# EAGLE design one_led (EAGLE 6.6.0)
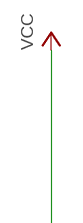
[diagram p0: schematic, sheet 1, part 1 of 2]
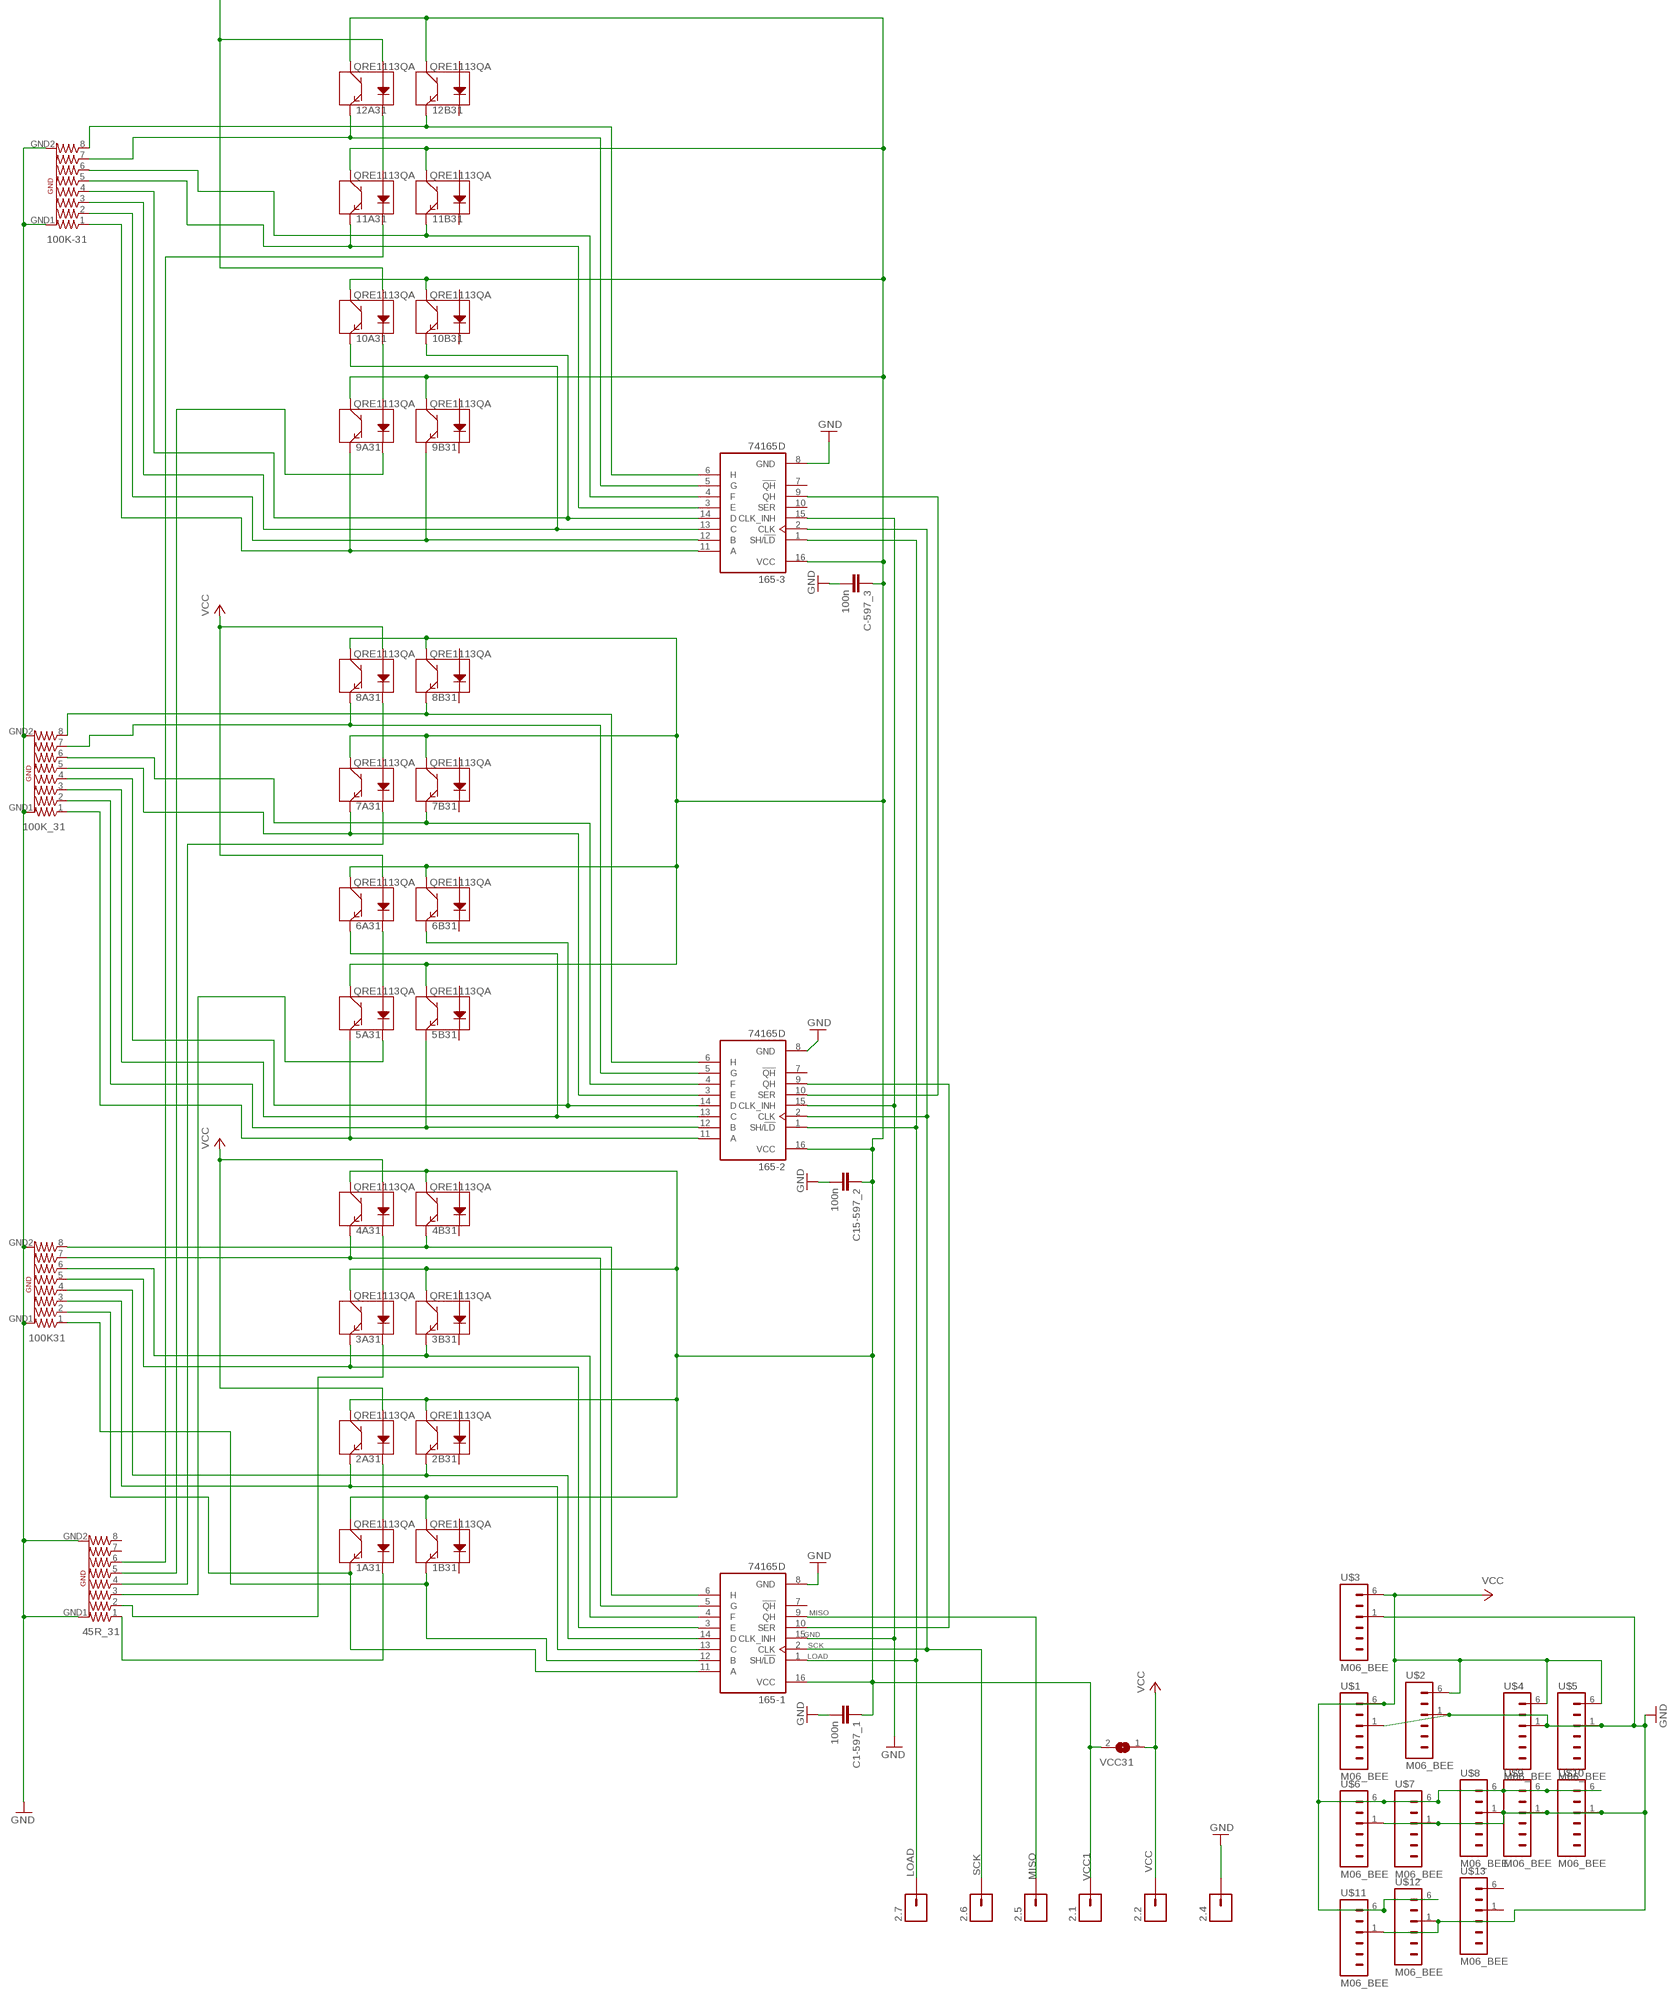
[diagram p1: schematic, sheet 1, part 2 of 2]

## Parts
1A31  QRE1113QA  [QRE1113]
1B31  QRE1113QA  [QRE1113]
2.1  M01ADN  [1X01-16GAUGE]
2.2  M01ADN  [1X01-16GAUGE]
2.4  M01ADN  [1X01-16GAUGE]
2.5  M01ADN  [1X01-16GAUGE]
2.6  M01ADN  [1X01-16GAUGE]
2.7  M01ADN  [1X01-16GAUGE]
2A31  QRE1113QA  [QRE1113]
2B31  QRE1113QA  [QRE1113]
3A31  QRE1113QA  [QRE1113]
3B31  QRE1113QA  [QRE1113]
4A31  QRE1113QA  [QRE1113]
4B31  QRE1113QA  [QRE1113]
5A31  QRE1113QA  [QRE1113]
5B31  QRE1113QA  [QRE1113]
6A31  QRE1113QA  [QRE1113]
6B31  QRE1113QA  [QRE1113]
7A31  QRE1113QA  [QRE1113]
7B31  QRE1113QA  [QRE1113]
8A31  QRE1113QA  [QRE1113]
8B31  QRE1113QA  [QRE1113]
9A31  QRE1113QA  [QRE1113]
9B31  QRE1113QA  [QRE1113]
10A31  QRE1113QA  [QRE1113]
10B31  QRE1113QA  [QRE1113]
11A31  QRE1113QA  [QRE1113]
11B31  QRE1113QA  [QRE1113]
12A31  QRE1113QA  [QRE1113]
12B31  QRE1113QA  [QRE1113]
45R_31  RESISTOR-ARRAY_BUSSED  [1608_ARRAY]
100K31  RESISTOR-ARRAY_BUSSED  [1608_ARRAY]
100K-31  RESISTOR-ARRAY_BUSSED  [1608_ARRAY]
100K_31  RESISTOR-ARRAY_BUSSED  [1608_ARRAY]
165-1  74165D  [SO16]
165-2  74165D  [SO16]
165-3  74165D  [SO16]
C1-597_1  100n  C-EUC0603  [C0603]
C15-597_2  100n  C-EUC0603  [C0603]
C-597_3  100n  C-EUC0603  [C0603]
U$1  M06_BEE  [1X06_BEE]
U$2  M06_BEE  [1X06_BEE]
U$3  M06_BEE  [1X06_BEE]
U$4  M06_BEE  [1X06_BEE]
U$5  M06_BEE  [1X06_BEE]
U$6  M06_BEE  [1X06_BEE]
U$7  M06_BEE  [1X06_BEE]
U$8  M06_BEE  [1X06_BEE]
U$9  M06_BEE  [1X06_BEE]
U$10  M06_BEE  [1X06_BEE]
U$11  M06_BEE  [1X06_BEE]
U$12  M06_BEE  [1X06_BEE]
U$13  M06_BEE  [1X06_BEE]
VCC31  SJ  [SJ]

## Nets
GND: 2.4.1 45R_31.GND1 45R_31.GND2 100K31.GND1 100K31.GND2 100K-31.GND1 100K-31.GND2 100K_31.GND1 100K_31.GND2 165-1.8(GND) 165-1.15(CLK_INH) 165-2.8(GND) 165-2.15(CLK_INH) 165-3.8(GND) 165-3.15(CLK_INH) C1-597_1.2 C15-597_2.2 C-597_3.2 U$1.1 U$2.1 U$3.1 U$4.1 U$5.1 U$6.1 U$7.1 U$8.1 U$9.1 U$10.1 U$11.1 U$12.1
LOAD: 2.7.1 165-1.1(SH/!LD) 165-2.1(SH/!LD) 165-3.1(SH/!LD)
MISO: 2.5.1 165-1.9(QH)
N$18: 3A31.4(E) 100K31.5 165-1.3(E)
N$21: 165-2.10(SER) 165-3.9(QH)
N$30: 1A31.4(E) 100K31.2 165-1.11(A)
N$31: 3A31.2(K) 45R_31.2
N$34: 165-1.10(SER) 165-2.9(QH)
N$48: 1A31.1(A) 2A31.2(K)
N$56: 1A31.2(K) 45R_31.1
N$58: 3B31.4(E) 100K31.6 165-1.4(F)
N$74: 5A31.1(A) 6A31.2(K)
N$78: 6A31.4(E) 100K_31.3 165-2.13(C)
N$94: 5A31.2(K) 45R_31.3
N$100: 1B31.4(E) 100K31.1 165-1.12(B)
N$101: 2A31.4(E) 100K31.3 165-1.13(C)
N$102: 2B31.4(E) 100K31.4 165-1.14(D)
N$103: 3A31.1(A) 4A31.2(K)
N$105: 6B31.4(E) 100K_31.4 165-2.14(D)
N$107: 7A31.1(A) 8A31.2(K)
N$108: 4A31.4(E) 100K31.7 165-1.5(G)
N$109: 4B31.4(E) 100K31.8 165-1.6(H)
N$111: 8A31.4(E) 100K_31.7 165-2.5(G)
N$112: 8B31.4(E) 100K_31.8 165-2.6(H)
N$113: 7A31.2(K) 45R_31.4
N$115: 7A31.4(E) 100K_31.5 165-2.3(E)
N$117: 7B31.4(E) 100K_31.6 165-2.4(F)
N$118: 5B31.4(E) 100K_31.2 165-2.12(B)
N$119: 5A31.4(E) 100K_31.1 165-2.11(A)
N$127: 9A31.1(A) 10A31.2(K)
N$130: 10A31.4(E) 100K-31.3 165-3.13(C)
N$131: 10B31.4(E) 100K-31.4 165-3.14(D)
N$132: 11A31.1(A) 12A31.2(K)
N$134: 12A31.4(E) 100K-31.7 165-3.5(G)
N$135: 12B31.4(E) 100K-31.8 165-3.6(H)
N$136: 11A31.2(K) 45R_31.6
N$138: 11A31.4(E) 100K-31.5 165-3.3(E)
N$140: 11B31.4(E) 100K-31.6 165-3.4(F)
N$141: 9B31.4(E) 100K-31.2 165-3.12(B)
N$142: 9A31.4(E) 100K-31.1 165-3.11(A)
N$143: 9A31.2(K) 45R_31.5
SCK: 2.6.1 165-1.2(CLK) 165-2.2(CLK) 165-3.2(CLK)
VCC: 2.2.1 2A31.1(A) 4A31.1(A) 6A31.1(A) 8A31.1(A) 10A31.1(A) 12A31.1(A) U$1.6 U$2.6 U$3.6 U$4.6 U$5.6 U$6.6 U$7.6 U$8.6 U$9.6 U$10.6 U$11.6 U$12.6 VCC31.1
VCC1: 1A31.3(C) 1B31.3(C) 2.1.1 2A31.3(C) 2B31.3(C) 3A31.3(C) 3B31.3(C) 4A31.3(C) 4B31.3(C) 5A31.3(C) 5B31.3(C) 6A31.3(C) 6B31.3(C) 7A31.3(C) 7B31.3(C) 8A31.3(C) 8B31.3(C) 9A31.3(C) 9B31.3(C) 10A31.3(C) 10B31.3(C) 11A31.3(C) 11B31.3(C) 12A31.3(C) 12B31.3(C) 165-1.16(VCC) 165-2.16(VCC) 165-3.16(VCC) C1-597_1.1 C15-597_2.1 C-597_3.1 VCC31.2
Unconnected: 1B31.1(A) 1B31.2(K) 2B31.1(A) 2B31.2(K) 3B31.1(A) 3B31.2(K) 4B31.1(A) 4B31.2(K) 5B31.1(A) 5B31.2(K) 6B31.1(A) 6B31.2(K) 7B31.1(A) 7B31.2(K) 8B31.1(A) 8B31.2(K) 9B31.1(A) 9B31.2(K) 10B31.1(A) 10B31.2(K) 11B31.1(A) 11B31.2(K) 12B31.1(A) 12B31.2(K) 45R_31.7 45R_31.8 165-1.7(!QH) 165-2.7(!QH) 165-3.7(!QH) 165-3.10(SER) U$13.1 U$13.6

## Library data of the parts
1A31 1B31 2A31 2B31 3A31 3B31 4A31 4B31 5A31 5B31 6A31 6B31 7A31 7B31 8A31 8B31 9A31 9B31 10A31 10B31 11A31 11B31 12A31 12B31 = BeeCounter2:QRE1113: Reflective object sensor
2.1 2.2 2.4-2.7 = OMSI - ADN:M01: Header 1 Standard 1-pin 0.1" header. Use with straight break away headers (SKU : PRT-00116), right angle break away headers (PRT-00553), swiss pins (PRT-00743), machine pins (PRT-00117), and female headers (PRT-00115).
45R_31 100K31 100K-31 100K_31 = Bee Counter 3:RESISTOR-ARRAY_BUSSED: Resistor Array http://industrial.panasonic.com/lecs/www-data/pdf/AOC0000/AOC0000CE3.pdf Digikey: U8470CT-ND Panasonic bussed EXB-E10
165-1-165-3 = SparkFun-DigitalIC:74*165
C1-597_1 C15-597_2 C-597_3 = resistor:C-EU: CAPACITOR, European symbol
U$1-U$13 = Bee Counter 3:M06_BEE
VCC31 = jumper:SJ: SMD solder JUMPER

## Board
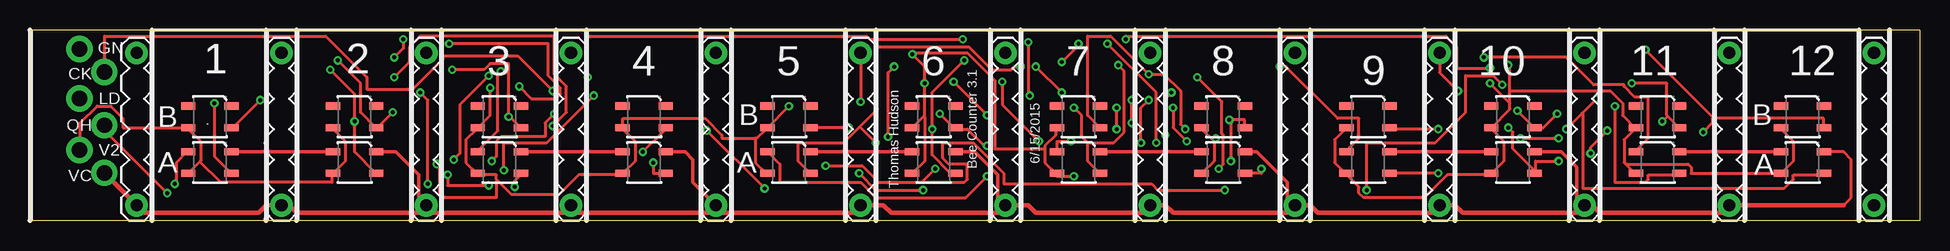
[diagram p2: board, top side]
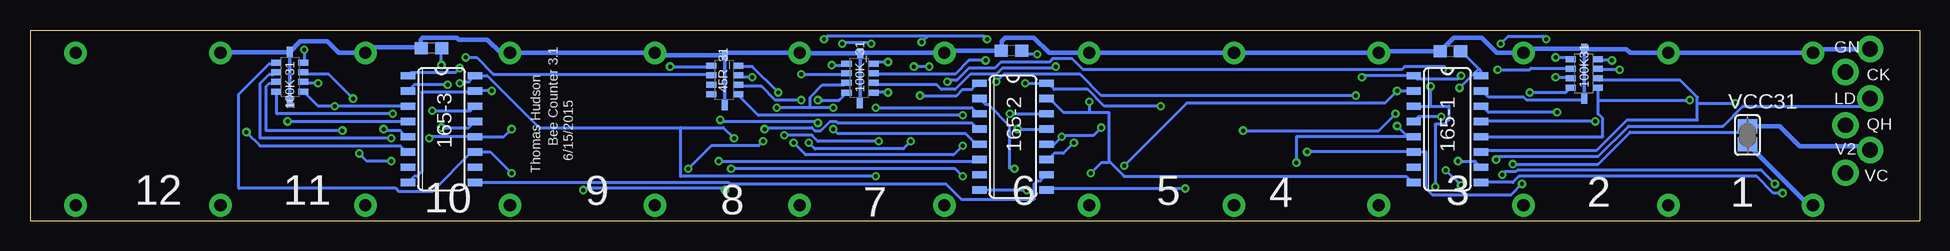
[diagram p3: board, bottom side, seen from below]

Size 157.48 x 15.88 mm. Coordinates in mm from the lower left corner, seen from the top.
Outline: 157.48,15.88 0,15.88 0,0 157.48,0 157.48,15.88
Copper layers (1*16): Top 0.0356mm / dielectric 1.5011mm / Bottom 0.0356mm
Design rules "default": minimum track width 10mil, minimum drill 13mil, track to track 6mil, track to pad 10mil, pad to pad 15mil, via to via 10mil, smd to smd 6mil, copper to edge 15mil, drill to drill 6mil, minimum pad ring 7mil, minimum via ring 7mil, stop-mask expansion 4mil, vias tented up to drill 25mil, thermal gap 10mil

### Footprints (pad centres in the part's own frame; a part is rotated, then mirrored left to right if it is on the bottom)
QRE1113 = smd 1.2 x 0.6: 1 -1.8,-0.9; 2 1.8,-0.9; 3 1.8,0.9; 4 -1.8,0.9
1X01-16GAUGE = drill 1.29 pad 2.184: 1 0,0
1608_ARRAY = smd 0.5 x 0.85: 1 -2.99,0.83; 2 -2.19,0.83; 3 -1.39,0.83; 4 -0.59,0.83; 5 -0.59,3.08; 6 -1.39,3.08; 7 -2.19,3.08; 8 -2.99,3.08 | smd 0.85 x 0.5: GND1 -3.88,1.96; GND2 0.28,1.94
SO16 = smd 0.6 x 1.2: 1 -4.445,-2.8; 2 -3.175,-2.8; 3 -1.905,-2.8; 4 -0.635,-2.8; 5 0.635,-2.8; 6 1.905,-2.8; 7 3.175,-2.8; 8 4.445,-2.8; 9 4.445,2.8; 10 3.175,2.8; 11 1.905,2.8; 12 0.635,2.8; 13 -0.635,2.8; 14 -1.905,2.8; 15 -3.175,2.8; 16 -4.445,2.8
C0603 = smd 1.1 x 1: 1 -0.85,0; 2 0.85,0
1X06_BEE = drill 1.016 pad 1.88: 1 -2.54,0; 6 10.16,0
SJ = smd 1.168 x 1.6: 1 -0.762,0; 2 0.762,0

### Placement (x,y rotation side)
1A31  14.99,4.83 180 top
1B31  14.99,8.64 180 top
2.1  4.13,5.87 0 top
2.2  6.19,3.97 0 top
2.4  4.13,14.29 0 top
2.5  6.19,7.94 0 top
2.6  6.19,12.38 0 top
2.7  4.13,10.16 0 top
2A31  27.05,4.83 180 top
2B31  27.05,8.64 180 top
3A31  39.12,4.83 180 top
3B31  39.12,8.64 180 top
4A31  51.18,4.83 180 top
4B31  51.18,8.64 180 top
5A31  63.25,4.83 180 top
5B31  63.25,8.64 180 top
6A31  75.31,4.83 180 top
6B31  75.31,8.64 180 top
7A31  87.38,4.83 180 top
7B31  87.38,8.64 180 top
8A31  99.44,4.83 180 top
8B31  99.44,8.64 180 top
9A31  111.51,4.83 180 top
9B31  111.51,8.64 180 top
10A31  123.57,4.83 180 top
10B31  123.57,8.64 180 top
11A31  135.64,4.83 180 top
11B31  135.64,8.64 180 top
12A31  147.7,4.83 180 top
12B31  147.7,8.64 180 top
45R_31  97.63,13.49 90 bottom
100K31  26,14.03 90 bottom
100K-31  137.8,10.16 270 bottom
100K_31  86.36,13.65 90 bottom
165-1  39.37,7.62 270 bottom
165-2  75.56,6.99 270 bottom
165-3  123.19,7.62 270 bottom
C1-597_1  75.69,14.16 180 bottom
C15-597_2  39.12,14.1 180 bottom
C-597_3  124.02,14.35 180 bottom
U$1  20.95,11.43 270 top
U$2  33.02,11.43 270 top
U$3  8.89,11.43 270 top
U$4  45.09,11.43 270 top
U$5  57.15,11.43 270 top
U$6  69.22,11.43 270 top
U$7  81.28,11.43 270 top
U$8  93.34,11.43 270 top
U$9  105.41,11.43 270 top
U$10  117.47,11.43 270 top
U$11  129.54,11.43 270 top
U$12  141.61,11.43 270 top
U$13  153.67,11.43 270 top
VCC31  14.35,7.11 90 bottom

### Tracks (layer width: path | path; a pad name or v marks a point on that pad's centre or on a via)
GND  (via drill 0.33)
  Top 0.254: v74.42,2.54 70.49,2.54 v69.09,3.94 | v119,10.79 117.47,12.32 U$10.1 | U$6.1 v69.22,9.91
  Bottom 0.254: 165-1.8 42.29,3.17 42.8,3.68 66.29,3.68 67.5,4.89 | 67.5,4.89 67.56,4.95 67.56,9.02 69.22,9.02 | 69.22,9.02 71.37,9.02 72.52,10.16 165-2.15 | v74.42,2.54 165-2.8 | v69.09,3.94 68.2,4.83 67.56,4.83 67.5,4.89 | 165-3.8 125.48,3.68 125.22,3.68 124.84,4.06 124.84,10.67 120.52,10.67 165-3.15 v119,10.79 | 165-1.15 36.45,10.79 35.94,10.29 33.02,10.29 32.77,10.03 28.07,10.03 100K31.GND1 | U$12.1 141.53,14.04 | v69.22,9.91 69.22,9.02
  Bottom 0.305: 27.92,14.29 100K31.GND2 27.94,10.17 100K31.GND1 | 76.52,14.19 C1-597_1.2 | 88.26,13.97 100K_31.GND2 88.3,9.79 100K_31.GND1 | 93.31,13.93 U$8.1 | 99.38,13.97 45R_31.GND2 99.57,9.63 45R_31.GND1 | 105.21,13.77 U$9.1 | U$10.1 118.27,13.97 | 124.94,14.42 C-597_3.2 | 100K-31.GND1 135.84,9.9 100K-31.GND2
  Bottom 0.381: 2.4.1 8.57,14.29 U$3.1 U$1.1 24.13,13.97 24.45,14.29 27.92,14.29 | 100K31.GND2 32.68,14.31 U$2.1 35.24,13.97 36.51,15.24 38.82,15.24 C15-597_2.2 44.96,14.1 U$4.1 U$5.1 U$6.1 72.55,13.97 73.82,15.24 76.2,15.24 76.52,14.92 76.52,14.19 | C1-597_1.2 81.09,14.16 U$7.1 88.26,13.97 | 100K_31.GND2 93.31,13.93 | U$8.1 99.38,13.97 | 45R_31.GND2 105.21,13.77 | U$9.1 U$10.1 | 118.27,13.97 119.38,15.08 121.76,15.08 121.92,15.24 124.78,15.24 124.94,15.08 124.94,14.42 129.09,14.42 U$11.1 131.76,13.97 132.72,14.92 134.95,14.92 100K-31.GND1 141.53,14.04
LOAD  (via drill 0.33)
  Top 0.254: v83.31,10.41 83.19,10.54 v83.19,14.86 | v77.72,15.11 69.98,15.11 69.72,15.37 46.48,15.37 v46.48,11.94 | v121.67,12.7 118.87,12.7 118.87,14.48 117.98,15.37 91.31,15.37 v91.31,15.11 | v35.31,5.08 35.81,5.59 35.81,9.65 v38.23,12.06
  Bottom 0.254: v83.31,10.41 80.26,10.41 79.76,10.92 78.99,10.92 78.49,11.43 165-2.1 | 82.74,15.3 82.68,15.37 77.98,15.37 v77.72,15.11 | 82.74,15.3 v83.19,14.86 | v46.48,11.94 46.35,12.06 165-1.1 41.91,11.81 38.48,11.81 v38.23,12.06 | v121.67,12.7 122.05,12.32 125.73,12.32 165-3.1 | v91.31,15.11 91.06,15.37 82.8,15.37 82.74,15.3 | v35.31,5.08 35.05,5.33 26.8,5.33 24.26,7.87 16.38,7.87 14.73,9.53 4.83,9.53 4.19,10.16 2.7.1
MISO  (via drill 0.33)
  Top 0.254: v11.43,2.29 6.22,7.49 6.22,7.87 2.5.1
  Bottom 0.254: 165-1.9 33.91,3.17 33.4,3.68 13.59,3.68 12.19,2.29 v11.43,2.29
N$18  (via drill 0.33)
  Top 0.254: v30.35,13.59 31.12,14.35 v31.12,15.11 | v34.92,14.73 43.18,14.73 43.18,12.06 44.2,11.05 44.2,10.54 43.81,10.16 41.78,10.16 v40.77,11.18 | v40.39,2.79 40.39,3.3 40.89,3.81 3A31.4
  Bottom 0.254: v30.35,13.59 29.34,13.59 29.21,13.46 100K31.5 | v31.12,15.11 31.37,15.37 34.29,15.37 v34.92,14.73 | 40.77,9.53 v40.77,11.18 | 165-1.3 40.77,9.53 | v40.39,2.79 40.39,8 39.62,8 39.24,8.38 39.24,9.53 40.77,9.53
N$21
  Bottom 0.254: 165-3.9 99.31,3.17 99.19,3.05 81.15,3.05 79.88,1.78 73.79,1.78 73.79,3.05 73.53,3.3 73.28,3.3 165-2.10
N$30  (via drill 0.33)
  Top 0.254: v15.37,9.78 15.37,5.33 16.76,3.94 1A31.4
  Bottom 0.254: 18.54,9.78 18.54,8.38 24.38,8.38 26.92,5.84 36.32,5.84 36.45,5.71 165-1.11 | 18.54,9.78 18.54,10.29 19.94,11.68 26.67,11.68 26.8,11.81 100K31.2 | 18.54,9.78 v15.37,9.78
N$31  (via drill 0.33)
  Top 0.254: v93.22,10.03 92.58,9.4 v92.58,6.48 | v84.07,6.6 81.03,9.65 v81.03,11.56 | v39.24,12.45 38.99,12.19 38.99,7.49 37.34,5.84 3A31.2
  Bottom 0.254: v93.22,10.03 95.38,10.03 96.52,11.18 98.3,11.18 98.43,11.3 45R_31.2 | v92.58,6.48 92.07,5.97 84.71,5.97 v84.07,6.6 | v81.03,11.56 80.9,11.68 80.26,11.68 79.25,12.7 77.09,12.7 76.58,13.21 72.52,13.21 72.26,13.46 70.61,13.46 69.72,12.57 43.18,12.57 42.93,12.83 39.62,12.83 v39.24,12.45
N$34  (via drill 0.33)
  Top 0.254: v38.48,4.95 38.86,5.33 38.86,6.6 39.24,6.99 42.93,6.99 42.93,8.13 v43.69,8.89 | v61.21,2.67 v56.39,7.49
  Bottom 0.254: v38.48,4.95 37.08,4.95 165-1.10 | v43.69,8.89 45.09,7.49 v56.39,7.49 | v61.21,2.67 72.52,2.67 72.64,2.54 165-2.9
N$48
  Top 0.305: 1A31.1 2A31.2
N$56  (via drill 0.33)
  Top 0.254: v76.96,11.56 v79.76,8.76 | v46.99,10.41 43.05,6.48 39.5,6.48 v39.5,4.19 | v38.23,2.92 34.8,2.92 v34.8,3.81 | v12.07,3.05 12.19,3.17 12.19,4.83 13.08,5.71 1A31.2
  Bottom 0.254: v79.76,8.76 96.77,8.76 98.43,10.41 45R_31.1 | v76.96,11.56 76.33,12.19 69.98,12.19 68.2,10.41 v46.99,10.41 | v38.23,2.92 v39.5,4.19 | v34.8,3.81 34.54,4.06 33.66,4.06 33.53,4.19 13.21,4.19 v12.07,3.05
N$58  (via drill 0.33)
  Top 0.254: v35.18,12.57 37.85,12.57 38.35,13.08 39.88,13.08 39.88,8.76 39.94,8.7 | 39.94,8.7 40.89,7.75 3B31.4 | v39.88,8.64 39.94,8.7
  Bottom 0.254: v35.18,12.57 32.51,12.57 32.38,12.7 29.21,12.7 100K31.6 | v39.88,8.64 41.78,8.64 165-1.4
N$74
  Top 0.305: 5A31.1 6A31.2
N$78  (via drill 0.33)
  Top 0.254: v77.85,13.34 75.18,10.67 v75.18,7.62 75.18,5.46 76.71,3.94 77.09,3.94 6A31.4
  Bottom 0.254: v77.85,13.34 79.25,13.34 80.39,12.19 87.12,12.19 100K_31.3 | v75.18,7.62 165-2.13
N$94  (via drill 0.33)
  Top 0.254: v97.28,11.94 99.31,9.91 99.31,7.24 99.44,7.11 99.44,4.7 v99.06,4.32 | v79.76,3.68 77.98,1.91 70.49,1.91 69.22,3.17 62.48,3.17 62.48,4.7 61.47,5.71 5A31.2
  Bottom 0.254: v97.28,11.94 98.3,11.94 98.43,12.06 45R_31.3 | v99.06,4.32 80.39,4.32 v79.76,3.68
N$100  (via drill 0.33)
  Top 0.254: v19.18,10.03 16.89,7.75 1B31.4
  Bottom 0.254: 26.8,10.03 26.8,8.89 26.42,8.51 26.42,6.99 165-1.12 | 26.8,10.03 26.8,10.92 100K31.1 | 26.8,10.03 v19.18,10.03
N$101  (via drill 0.33)
  Top 0.254: v25.02,12.57 27.05,10.54 v27.05,8.26 27.05,5.71 28.83,3.94 2A31.4
  Bottom 0.254: v25.02,12.57 26.8,12.57 100K31.3 | v27.05,8.26 165-1.13
N$102  (via drill 0.33)
  Top 0.254: v25.65,13.34 27.56,11.43 27.56,9.02 28.83,7.75 2B31.4 28.96,7.75 v30.23,9.02
  Bottom 0.254: v25.65,13.34 26.8,13.34 100K31.4 | v30.23,9.02 35.94,9.02 36.45,9.53 165-1.14
N$103
  Top 0.305: 3A31.1 4A31.2
N$105  (via drill 0.33)
  Top 0.254: v85.98,13.21 87.38,14.61 v87.38,14.73 | v89.79,14.73 93.85,10.67 v93.85,6.48 | v79.76,6.22 79.5,6.22 78.1,7.62 77.22,7.62 6B31.4 77.09,7.62 v75.82,8.89
  Bottom 0.254: v85.98,13.21 87,13.21 87.12,13.08 100K_31.4 | v87.38,14.73 87.5,14.86 89.66,14.86 v89.79,14.73 | v93.85,6.48 92.84,5.46 80.52,5.46 v79.76,6.22 | v75.82,8.89 165-2.14
N$107
  Top 0.305: 7A31.1 8A31.2
N$108  (via drill 0.33)
  Top 0.254: v30.35,11.94 31.62,13.21 31.62,14.48 32.51,15.37 43.69,15.37 43.69,12.19 44.7,11.18 44.7,9.02 v43.56,7.87 | v51.94,4.83 51.94,3.94 52.96,3.94 4A31.4
  Bottom 0.254: v30.35,11.94 29.21,11.94 100K31.7 | 42.74,7.05 42.67,6.99 165-1.5 | 42.74,7.05 v43.56,7.87 | v51.94,4.83 51.94,6.99 42.8,6.99 42.74,7.05
N$109  (via drill 0.33)
  Top 0.254: v32.51,10.67 33.15,10.03 v33.15,3.05 | v51.05,5.71 52.96,7.62 4B31.4
  Bottom 0.254: v32.51,10.67 29.46,10.67 29.21,10.92 100K31.8 | v33.15,3.05 34.04,2.16 40.64,2.16 41.15,2.67 41.15,5.71 165-1.6 v51.05,5.71
N$111  (via drill 0.33)
  Top 0.254: v90.55,7.62 v90.55,9.4 | v102.62,4.32 102.62,3.94 101.35,3.94 8A31.4 | v96.39,6.6 95.25,7.75 v95.25,9.4
  Bottom 0.254: 92.46,9.4 92.46,10.29 91.44,11.3 89.66,11.3 89.53,11.43 100K_31.7 | v90.55,9.4 92.46,9.4 | v90.55,7.62 90.17,7.24 79.5,7.24 78.61,6.35 165-2.5 | v102.62,4.32 100.71,6.22 96.77,6.22 v96.39,6.6 | 92.46,9.4 v95.25,9.4
N$112  (via drill 0.33)
  Top 0.254: v91.82,8.13 v91.82,10.03 | 100.08,8.38 101.22,8.38 101.22,7.75 8B31.4 | 100.08,8.38 v100.08,4.95 | 100.08,8.38 v99.95,8.38
  Bottom 0.254: v91.82,10.03 90.04,10.03 89.53,10.54 100K_31.8 | v91.82,8.13 91.95,8.26 99.82,8.26 v99.95,8.38 | v100.08,4.95 78.61,4.95 78.49,5.08 165-2.6
N$113  (via drill 0.33)
  Top 0.254: v95.12,10.67 94.62,10.16 v94.62,7.11 | v86.74,6.6 85.6,6.6 85.6,5.84 7A31.2
  Bottom 0.254: v95.12,10.67 97.28,12.83 98.43,12.83 45R_31.4 | v94.62,7.11 92.33,7.11 91.82,6.6 v86.74,6.6
N$115  (via drill 0.33)
  Top 0.254: v90.68,12.95 91.19,12.45 91.19,7.37 90.3,6.48 88.14,6.48 | 88.14,6.48 88.14,4.95 89.15,3.94 7A31.4 | v87,9.4 87.63,8.76 87.63,6.99 88.14,6.48
  Bottom 0.254: v90.68,12.95 89.53,12.95 100K_31.5 | v87,9.4 78.99,9.4 78.49,8.89 165-2.3
N$117  (via drill 0.33)
  Top 0.254: 7B31.4 89.15,7.75 88.14,8.76 88.14,15.37 90.04,15.37 v93.22,12.19 94.49,12.19 95.88,10.79 95.88,8 v96.27,7.62
  Bottom 0.254: v93.22,12.19 89.53,12.19 100K_31.6 | v96.27,7.62 96.14,7.75 92.33,7.75 92.07,7.49 91.57,7.49 90.81,8.26 90.3,8.26 90.17,8.13 78.99,8.13 78.49,7.62 165-2.4
N$118  (via drill 0.33)
  Top 0.254: v72.01,12.83 71.5,12.32 v71.5,6.99 | v68.2,7.75 65.15,7.75 5B31.4
  Bottom 0.254: v72.01,12.83 72.14,12.7 76.45,12.7 76.96,12.19 79.12,12.19 80.39,10.92 81.53,10.92 81.91,11.3 87,11.3 87.12,11.43 100K_31.2 | 165-2.12 72.14,6.35 v71.5,6.99 71.37,7.11 68.83,7.11 v68.2,7.75
N$119  (via drill 0.33)
  Top 0.254: v83.82,12.83 v85.98,10.67 | v82.55,12.83 82.04,12.83 81.79,12.57 80.14,12.57 78.23,14.48 70.61,14.48 70.61,9.27 69.15,7.81 | 69.15,7.81 67.82,6.48 64.01,6.48 64.01,4.95 65.02,3.94 5A31.4 | 69.15,7.81 v70.49,6.48
  Bottom 0.254: v85.98,10.67 87.12,10.67 100K_31.1 | v82.55,12.83 v83.82,12.83 | v70.49,6.48 71.37,5.59 72.14,5.59 72.64,5.08 165-2.11
N$127
  Top 0.305: 9A31.1 10A31.2
N$130  (via drill 0.33)
  Top 0.254: v131.44,7.49 130.05,6.1 v130.05,5.59 | v127.38,4.95 125.48,4.95 125.48,4.06 | 125.48,4.06 125.48,3.94 10A31.4 125.48,4.06 | v123.19,7.75 123.57,7.37 123.57,5.97 125.48,4.06
  Bottom 0.254: v131.44,7.49 137.8,7.49 137.8,11.18 137.54,11.43 137.03,11.43 100K-31.3 | v130.05,5.59 129.41,4.95 v127.38,4.95 | v123.19,7.75 120.9,7.75 165-3.13
N$131  (via drill 0.33)
  Top 0.254: v127.25,8.89 126.11,7.75 125.48,7.75 10B31.4 125.35,7.75 v123.95,9.14
  Bottom 0.254: v127.25,8.89 136.91,8.89 136.91,10.67 100K-31.4 | v123.95,9.14 120.78,9.14 165-3.14
N$132
  Top 0.305: 11A31.1 12A31.2
N$134  (via drill 0.33)
  Top 0.254: v128.02,7.62 129.35,8.95 | 129.35,8.95 v130.56,10.16 | 12A31.4 149.48,3.81 146.94,3.81 146.94,3.43 146.18,2.67 129.41,2.67 129.41,8.89 129.35,8.95
  Bottom 0.254: v130.56,10.16 132.59,12.19 134.49,12.19 134.62,12.32 100K-31.7 | v128.02,7.62 127.89,7.49 126.62,7.49 126.11,6.99 165-3.5
N$135  (via drill 0.33)
  Top 0.254: 140.27,8.57 140.34,8.51 149.48,8.51 149.48,7.75 12B31.4 | 140.27,8.57 v134.62,14.22 | v139.45,7.37 140.21,8.13 140.21,8.51 140.27,8.57
  Bottom 0.254: v134.62,14.22 134.62,13.21 100K-31.8 | v139.45,7.37 138.3,6.22 126.62,6.22 126.11,5.71 165-3.6
N$136  (via drill 0.33)
  Top 0.254: v121.16,13.59 128.14,13.59 128.14,13.46 130.3,11.3 132.84,11.3 132.84,11.18 133.73,10.29 134.87,10.29 134.87,6.86 133.86,5.84 11A31.2
  Bottom 0.254: v121.16,13.59 120.27,13.59 118.87,12.19 100.84,12.19 45R_31.6
N$138  (via drill 0.33)
  Top 0.254: v132.08,9.53 132.08,3.17 134.62,3.17 134.87,3.43 134.87,3.81 137.41,3.81 11A31.4
  Bottom 0.254: 165-3.3 v132.08,9.53 133.48,9.53 134.62,10.67 100K-31.5
N$140  (via drill 0.33)
  Top 0.254: v133.48,11.43 136.4,11.43 136.4,8.76 136.46,8.7 | 136.46,8.7 137.41,7.75 11B31.4 | 136.46,8.7 v136.02,8.26
  Bottom 0.254: v133.48,11.43 134.62,11.43 100K-31.6 | v136.02,8.26 165-3.4
N$141  (via drill 0.33)
  Top 0.254: v124.21,6.86 v127.38,6.86 | v117.35,7.62 113.41,7.62 9B31.4
  Bottom 0.254: v127.38,6.86 138.3,6.86 138.3,11.43 137.54,12.19 137.16,12.19 137.03,12.32 100K-31.2 | v124.21,6.86 124.08,6.99 165-3.12 117.98,6.99 v117.35,7.62
N$142  (via drill 0.33)
  Top 0.254: v117.35,3.94 113.41,3.94 9A31.4
  Bottom 0.254: 100K-31.1 137.03,13.08 137.54,13.08 140.08,10.54 140.08,2.67 127,2.67 126.75,2.41 123.95,2.41 120.65,5.71 165-3.11 119.13,5.71 v117.35,3.94
N$143  (via drill 0.33)
  Top 0.254: v104.14,12.83 104.65,12.83 108.97,8.51 110.74,8.51 110.74,6.86 109.73,5.84 9A31.2
  Bottom 0.254: v104.14,12.83 100.84,12.83 45R_31.5
SCK  (via drill 0.33)
  Top 0.254: v43.56,10.79 40.64,13.72 34.42,13.72 34.42,13.46 31.88,10.92 28.07,10.92 28.07,11.94 24.64,15.37 6.22,15.37 6.22,12.45 2.6.1 | 74.36,3.24 74.29,3.17 70.49,3.17 70.49,3.43 69.34,4.57 v66.29,4.57 | 74.36,3.24 v75.44,4.32 | v122.68,11.3 121.92,12.06 119.63,12.06 119.63,9.02 117.09,6.48 111.38,6.48 v111.38,2.54 | v99.57,2.54 93.98,2.54 93.47,3.05 81.15,3.05 81.15,3.94 78.61,6.48 76.07,6.48 76.07,5.21 76.58,4.7 78.1,4.7 78.1,3.43 77.85,3.17 74.42,3.17 74.36,3.24
  Bottom 0.254: 165-1.2 v43.56,10.79 44.58,9.78 61.09,9.78 v66.29,4.57 | v75.44,4.32 75.82,4.32 75.82,7.87 77.6,9.65 77.85,9.65 165-2.2 | v122.68,11.3 125.48,11.3 165-3.2 | v111.38,2.54 111.25,2.67 99.69,2.67 v99.57,2.54
VCC
  Top 0.254: 151.13,1.27 151.77,1.91 151.77,5.08 151.13,5.71 149.51,5.71 12A31.1
  Top 0.305: 2A31.1 30.47,5.73 32.38,3.81 32.38,1.91 U$2.6 | 4A31.1 54.6,5.73 55.24,5.08 55.24,3.17 U$5.6 | 6A31.1 78.73,5.73 80.65,3.81 80.65,1.91 U$7.6 | 8A31.1 102.22,5.73 104.78,3.17 104.78,1.91 U$9.6 | 10A31.1 127.62,5.73 128.91,4.45 128.91,1.91 U$11.6
  Top 0.381: 151.13,1.27 U$12.6 140.97,0.64 130.81,0.64 130.18,1.27 U$11.6 128.91,0.64 119.38,0.64 118.75,1.27 U$10.6 116.84,0.64 107.31,0.64 106.68,1.27 U$9.6 104.78,0.64 95.25,0.64 94.62,1.27 U$8.6 92.71,0.64 83.82,0.64 83.19,1.27 U$7.6 80.65,0.64 71.75,0.64 71.12,1.27 U$6.6 68.58,0.64 57.78,0.64 U$5.6 56.52,0.64 45.72,0.64 U$4.6 44.45,0.64 33.66,0.64 U$2.6 32.38,0.64 22.23,0.64 21.59,1.27 U$1.6 19.68,1.27 19.05,0.64 9.53,0.64 U$3.6 2.2.1
  Bottom 0.381: U$3.6 9.27,1.27 VCC31.1
VCC1  (via drill 0.33)
  Top 0.254: 12B31.3 145.92,7.62 146.94,6.6 146.94,4.95 145.92,3.94 12A31.3 145.8,3.94 138.43,3.94 138.43,4.45 138.18,4.7 133.1,4.7 133.03,4.64 | 98.62,6.67 97.66,7.62 8B31.3 | 98.62,6.67 98.68,6.6 98.68,4.95 97.66,3.94 8A31.3 | 133.03,4.64 132.84,4.83 132.84,6.73 133.73,7.62 11B31.3 133.73,7.75 132.72,8.76 132.72,9.78 131.7,10.79 123.32,10.79 | 133.03,4.64 133.73,3.94 11A31.3 | 9B31.3 109.6,7.62 108.71,6.73 108.71,4.83 109.6,3.94 9A31.3 109.73,3.81 110.74,2.79 110.74,2.29 111.12,1.91 116.21,1.91 118.11,3.81 121.67,3.81 10A31.3 121.79,3.94 122.81,4.95 122.81,6.6 121.79,7.62 10B31.3 121.79,7.75 123.32,9.27 123.32,9.78 | v123.19,12.95 123.32,12.83 123.32,10.79 | 123.32,9.78 123.32,10.79 | 123.32,9.78 v121.67,11.43 | v98.81,6.86 98.62,6.67 | 14.16,4.89 14.22,4.95 14.22,6.6 13.21,7.62 1B31.3 13.08,7.75 7.75,7.75 7.75,8.51 6.73,9.53 5.59,9.53 4.19,8.13 4.19,5.97 2.1.1 | 14.16,4.89 13.21,3.94 1A31.3 | 2B31.3 25.27,7.62 26.29,6.6 26.29,4.95 25.27,3.94 2A31.3 25.15,3.81 25.15,3.17 15.88,3.17 14.16,4.89 | 84.58,5.97 84.58,6.22 85.47,7.11 85.47,7.62 7B31.3 | 84.58,5.97 84.58,4.83 85.47,3.94 7A31.3 85.6,3.81 85.6,3.68 v87,3.68 | 74.49,8.7 73.53,7.75 6B31.3 | 74.49,8.7 74.55,8.76 v74.55,11.43 74.55,12.83 v73.53,13.84 73.66,13.84 73.66,13.97 78.1,13.97 80.39,11.68 80.39,5.97 84.58,5.97 | 6A31.3 73.53,3.94 74.55,4.95 74.55,8.64 74.49,8.7 | v38.35,11.05 38.35,8.76 37.34,7.75 3B31.3 37.21,7.62 36.32,6.73 36.32,4.83 37.21,3.94 3A31.3 37.34,3.81 38.86,3.81 38.86,3.43 38.92,3.37 | 60.51,6.79 61.34,7.62 5B31.3 61.47,7.75 v63.25,9.53 | 60.51,6.79 60.45,6.73 60.45,4.83 61.34,3.94 5A31.3
  Top 0.254: 60.51,6.79 60.45,6.86 57.66,6.86 57.66,7.11 56.26,8.51 49.4,8.51 49.4,7.75 4B31.3 49.4,7.62 50.42,6.6 50.42,4.95 49.4,3.94 4A31.3 49.28,3.81 45.72,3.81 44.07,2.16 40.13,2.16 38.92,3.37 | v33.91,4.7 34.16,4.45 34.16,2.29 34.54,1.91 38.86,1.91 38.86,3.3 38.92,3.37
  Bottom 0.254: v123.19,12.95 123.19,14.35 C-597_3.1 | v121.67,11.43 121.54,11.56 120.9,11.56 165-3.16 119.38,12.06 115.06,7.75 103.25,7.75 | v98.81,6.86 99.69,7.75 103.25,7.75 | v73.53,13.84 74.55,13.84 74.8,14.1 C1-597_1.1 | v74.55,11.43 165-2.16 72.64,11.43 72.14,10.92 69.34,10.92 67.94,9.53 v63.25,9.53 | 36.77,12.64 36.58,12.45 165-1.16 | 36.77,12.64 38.23,14.1 C15-597_2.1 | v38.35,11.05 36.77,12.64 | VCC31.2 14.86,7.37 24.13,7.37 26.8,4.7 v33.91,4.7 | 103.25,7.75 103.25,3.68 v87,3.68
  Bottom 0.381: VCC31.2 11.68,7.87 10,6.19 4.45,6.19 2.1.1

### Text on the board
tPlace: Bee Counter 3.1 | 1 | 2 | 3 | 4 | 5 | 6 | 7 | 8 | 10 | 11 | 12 | 9 | 6/15/2015 | B | B | B | A | A | A | Thomas Hudson
bPlace: Bee Counter 3.1 | 6/15/2015 | 1 | 2 | 3 | 4 | 5 | 6 | 9 | Thomas Hudson | 11 | 12 | 7 | 8 | 10
tNames: GN | CK | LD | QH | V2 | VC
bNames: GN | CK | LD | QH | V2 | VC